# Altium project SecondBoard.PrjPcb
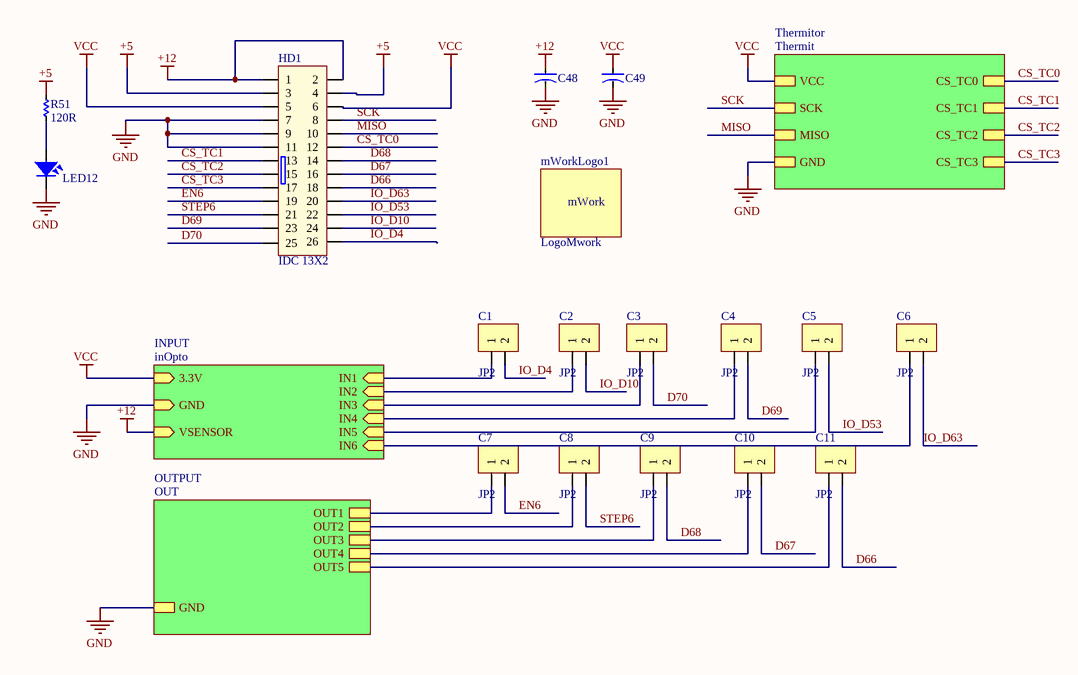
[diagram p0: Main.SchDoc]
4 sheets, 150 parts. Net scope: hierarchical (ports join the sheet entries above them; power ports are global).
Board file: second.PcbDoc
Sheets:
  Main.SchDoc
    Thermitor = Thermit.SchDoc
    INPUT = inOpto.SchDoc
    OUTPUT = OUT.SchDoc

## Sheet Main.SchDoc
size A

### Parts
C1  JP2  [JP2-CLOSED]
C2  JP2  [JP2-CLOSED]
C3  JP2  [JP2-CLOSED]
C4  JP2  [JP2-CLOSED]
C5  JP2  [JP2-CLOSED]
C6  JP2  [JP2-CLOSED]
C7  JP2  [JP2-CLOSED]
C8  JP2  [JP2-CLOSED]
C9  JP2  [JP2-CLOSED]
C10  JP2  [JP2-CLOSED]
C11  JP2  [JP2-CLOSED]
C48  CN-ALU-SMD  [CAP-ALU-SMD-F]  (value not drawn)
C49  CN-ALU-SMD  [CAP-ALU-SMD-F]  (value not drawn)
HD1  IDC 13X2  [IDC26-B]
LED12  LED  [LED-0805-Red]  (value not drawn)
mWorkLogo1  LogoMwork  [LogoMwork30*12]
R51  120R  [RES-SMD-0603_BIG]

### Sub-sheets
INPUT = inOpto: 3.3V (in), VSENSOR (in), GND (in), IN1 (in), IN4 (in), IN3 (in), IN5 (in), IN6 (in), IN2 (in)
OUTPUT = OUT: OUT5, OUT4, OUT1, OUT2, OUT3, GND
Thermitor = Thermit: VCC, SCK, MISO, CS_TC0, CS_TC1, GND, CS_TC2, CS_TC3

### Nets
+5: HD1.3 HD1.4 R51.2
+12: C48.1 HD1.1 HD1.2 ; sheet INPUT/VSENSOR
GND: C48.2 C49.2 HD1.7 HD1.9 HD1.11 LED12.2 ; sheet Thermitor/GND, sheet INPUT/GND, sheet OUTPUT/GND
VCC: C49.1 HD1.5 HD1.6 ; sheet Thermitor/VCC, sheet INPUT/3.3V
CS_TC0: HD1.12 ; sheet Thermitor/CS_TC0
CS_TC1: HD1.13 ; sheet Thermitor/CS_TC1
CS_TC2: HD1.15 ; sheet Thermitor/CS_TC2
CS_TC3: HD1.17 ; sheet Thermitor/CS_TC3
D66: C11.2 HD1.18
D67: C10.2 HD1.16
D68: C9.2 HD1.14
D69: C4.2 HD1.23
D70: C3.2 HD1.25
EN6: C7.2 HD1.19
IO_D4: C1.2 HD1.26
IO_D10: C2.2 HD1.24
IO_D53: C5.2 HD1.22
IO_D63: C6.2 HD1.20
MISO: HD1.10 ; sheet Thermitor/MISO
SCK: HD1.8 ; sheet Thermitor/SCK
STEP6: C8.2 HD1.21
NetC1_1: C1.1 ; sheet INPUT/IN1
NetC2_1: C2.1 ; sheet INPUT/IN2
NetC3_1: C3.1 ; sheet INPUT/IN3
NetC4_1: C4.1 ; sheet INPUT/IN4
NetC5_1: C5.1 ; sheet INPUT/IN5
NetC6_1: C6.1 ; sheet INPUT/IN6
NetC7_1: C7.1 ; sheet OUTPUT/OUT1
NetC8_1: C8.1 ; sheet OUTPUT/OUT2
NetC9_1: C9.1 ; sheet OUTPUT/OUT3
NetC10_1: C10.1 ; sheet OUTPUT/OUT4
NetC11_1: C11.1 ; sheet OUTPUT/OUT5
NetLED12_1: LED12.1 R51.1

### Notes on the sheet
- (in symbol LogoMwork) mWork

### Library data of the parts
C1-C11 = JP2: WR-PHD 2.54 mm Angled Socket Header; Manufacturer: W¨¹rth Elektronik eiSos GmbH; partNo: 613002143121; ComponentLink1 Description: Manufacturer; ComponentLink2 Description: Datasheet; NoPins: 02; Created Date: 29 March 2013; ComponentLink1URL: http://www.we-online.com; ComponentLink2URL: http://katalog.we-online.de/em/datasheet/6130xx143121.pdf; Created by: Karrer Zheng
C48 C49 = CN-ALU-SMD: Polarized Capacitor (Axial); Published: 8-Jun-2000; LatestRevisionDate: 17-Jul-2002; LatestRevisionNote: Re-released for DXP Platform.; PackageReference: POLAR0.8; Publisher: Altium Limited
HD1 = IDC 13X2: Value: Header 5x2
LED12 = LED SMD: Value: LED 3 - 5 ly 2 Colour
R51 = R

## Sheet Thermit.SchDoc
size A
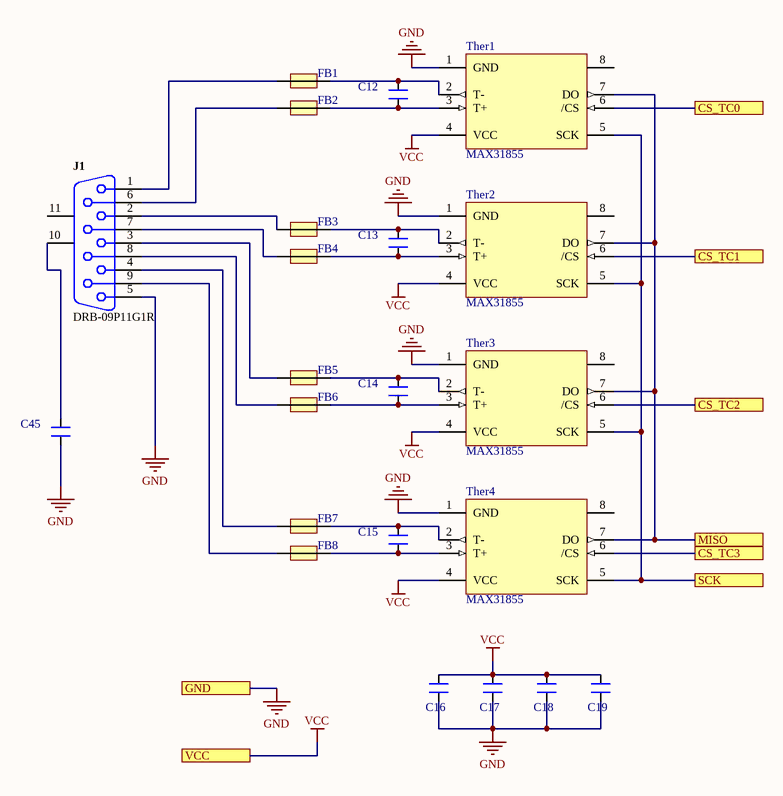
[diagram p1: Thermit.SchDoc]

### Parts
C12  10nF  [CN-SMD-0603_big]  (value not drawn)
C13  10nF  [CN-SMD-0603_big]  (value not drawn)
C14  10nF  [CN-SMD-0603_big]  (value not drawn)
C15  10nF  [CN-SMD-0603_big]  (value not drawn)
C16  100nF  [CN-SMD-0603_big]  (value not drawn)
C17  100nF  [CN-SMD-0603_big]  (value not drawn)
C18  100nF  [CN-SMD-0603_big]  (value not drawn)
C19  100nF  [CN-SMD-0603_big]  (value not drawn)
C45  10nF  [CN-SMD-0603_big]  (value not drawn)
FB1  FB  [Capacitor_805]  (value not drawn)
FB2  FB  [Capacitor_805]  (value not drawn)
FB3  FB  [Capacitor_805]  (value not drawn)
FB4  FB  [Capacitor_805]  (value not drawn)
FB5  FB  [Capacitor_805]  (value not drawn)
FB6  FB  [Capacitor_805]  (value not drawn)
FB7  FB  [Capacitor_805]  (value not drawn)
FB8  FB  [Capacitor_805]  (value not drawn)
J1  DRB-09P11G1R  [DB9_MALE]
Ther1  MAX31855  [SO8]
Ther2  MAX31855  [SO8]
Ther3  MAX31855  [SO8]
Ther4  MAX31855  [SO8]

### Ports
CS_TC0, CS_TC1, CS_TC2, CS_TC3, GND, MISO, SCK, VCC

### Nets
GND: C16.1 C17.1 C18.1 C19.1 C45.1 J1.5 Ther1.1(GND) Ther2.1(GND) Ther3.1(GND) Ther4.1(GND) ; port GND
VCC: C16.2 C17.2 C18.2 C19.2 Ther1.4(VCC) Ther2.4(VCC) Ther3.4(VCC) Ther4.4(VCC) ; port VCC
CS_TC0: Ther1.6(/CS) ; port CS_TC0
CS_TC1: Ther2.6(/CS) ; port CS_TC1
CS_TC2: Ther3.6(/CS) ; port CS_TC2
CS_TC3: Ther4.6(/CS) ; port CS_TC3
MISO: Ther1.7(DO) Ther2.7(DO) Ther3.7(DO) Ther4.7(DO) ; port MISO
SCK: Ther1.5(SCK) Ther2.5(SCK) Ther3.5(SCK) Ther4.5(SCK) ; port SCK
NetC12_1: C12.1 FB2.2 Ther1.3(T+)
NetC12_2: C12.2 FB1.2 Ther1.2(T-)
NetC13_1: C13.1 FB4.2 Ther2.3(T+)
NetC13_2: C13.2 FB3.2 Ther2.2(T-)
NetC14_1: C14.1 FB6.2 Ther3.3(T+)
NetC14_2: C14.2 FB5.2 Ther3.2(T-)
NetC15_1: C15.1 FB8.2 Ther4.3(T+)
NetC15_2: C15.2 FB7.2 Ther4.2(T-)
NetC45_2: C45.2 J1.10(MH1)
NetFB1_1: FB1.1 J1.1
NetFB2_1: FB2.1 J1.6
NetFB3_1: FB3.1 J1.2
NetFB4_1: FB4.1 J1.7
NetFB5_1: FB5.1 J1.3
NetFB6_1: FB6.1 J1.8
NetFB7_1: FB7.1 J1.4
NetFB8_1: FB8.1 J1.9

Not connected (* = marked no-connect by the designer): J1 11(MH2); Ther1 8; Ther2 8; Ther3 8; Ther4 8

### Library data of the parts
C12-C19 C45 = CN: Value: 33pF
J1 = CON 9 Male: Connector, DB9 R/A Through-hole Male; Connector type: Header; Max Current: 3A; Mounting Technology: Through-Hole; Pin Count: 9; Status: Unreleased; Category: Connector
Ther1-Ther4 = MAX31855: ComponentLink1Description: ADUM1201; ComponentLink1URL: https://thegioiic.com/products/adum1201arz

## Sheet inOpto.SchDoc
size A
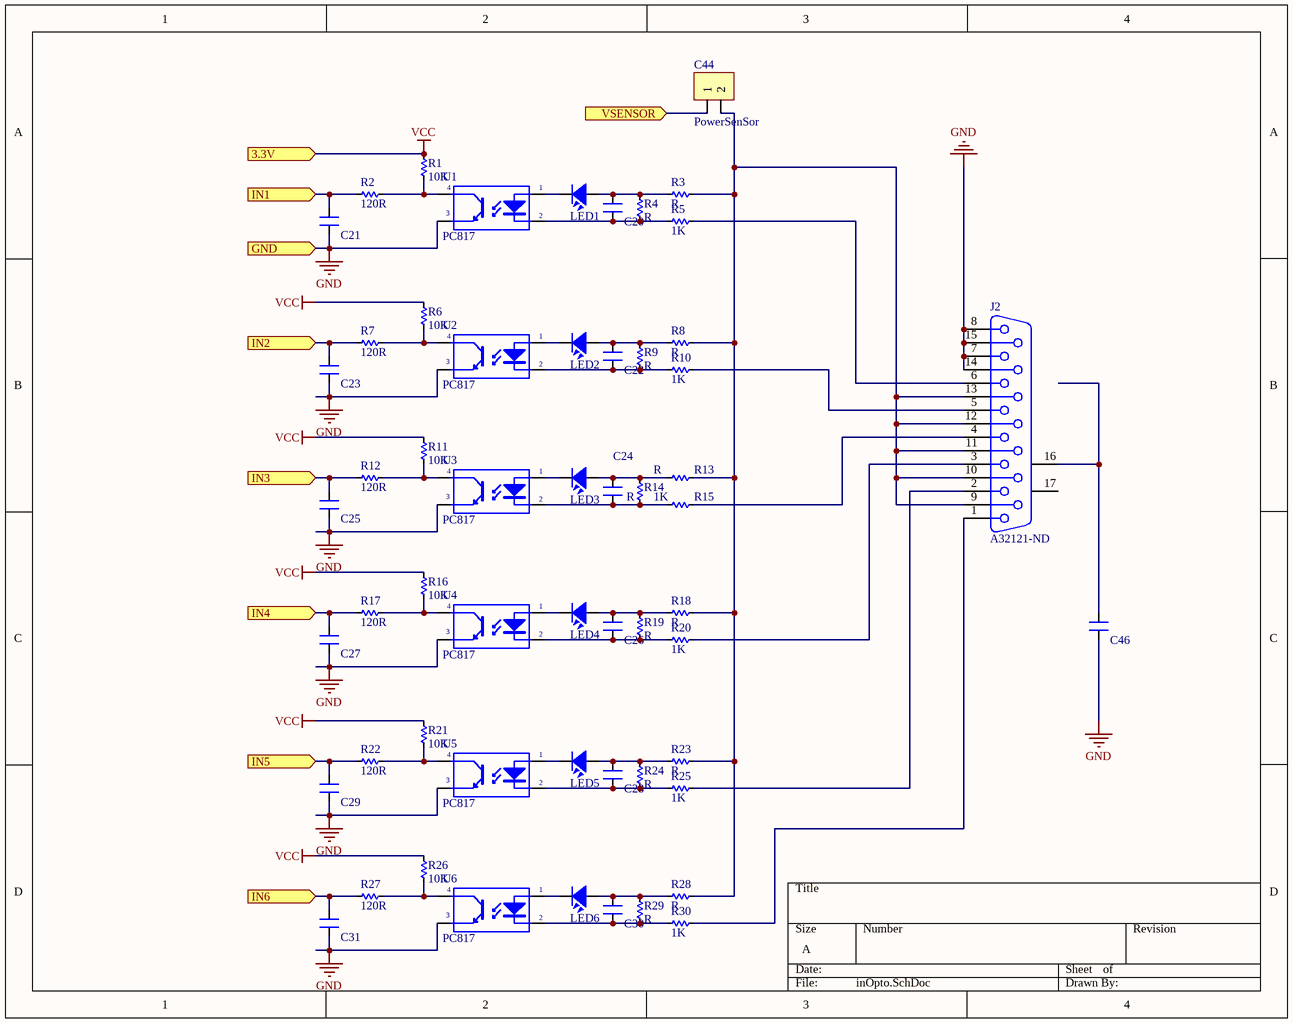
[diagram p2: inOpto.SchDoc]

### Parts
(Parts that share a designator on the sheet are numbered #1, #2 ... from top to bottom, then left to right.)
C20  CN  [CN-SMD-0603_big]  (value not drawn)
C21  CN  [CN-SMD-0603_big]  (value not drawn)
C22  CN  [CN-SMD-0603_big]  (value not drawn)
C23  CN  [CN-SMD-0603_big]  (value not drawn)
C24  CN  [CN-SMD-0603_big]  (value not drawn)
C25  CN  [CN-SMD-0603_big]  (value not drawn)
C26  CN  [CN-SMD-0603_big]  (value not drawn)
C27  CN  [CN-SMD-0603_big]  (value not drawn)
C28  CN  [CN-SMD-0603_big]  (value not drawn)
C29  CN  [CN-SMD-0603_big]  (value not drawn)
C30  CN  [CN-SMD-0603_big]  (value not drawn)
C31  CN  [CN-SMD-0603_big]  (value not drawn)
C44  PowerSenSor  [JP2-CLOSED]
C46  CN  [CN-SMD-0603_big]  (value not drawn)
J2#1  A32121-ND  [DB15]
LED1  MinZ  [LED-0805-Blue]  (value not drawn)
LED2  MinZ  [LED-0805-Blue]  (value not drawn)
LED3  MinZ  [LED-0805-Blue]  (value not drawn)
LED4  MinZ  [LED-0805-Blue]  (value not drawn)
LED5  MinZ  [LED-0805-Blue]  (value not drawn)
LED6  MinZ  [LED-0805-Blue]  (value not drawn)
R1  10K  [RES-SMD-0603_BIG]
R2  120R  [RES-SMD-0603_BIG]
R3  R  [RES-SMD-0603_BIG]
R4  R  [RES-SMD-0603_BIG]
R5  1K  [RES-SMD-0603_BIG]
R6  10K  [RES-SMD-0603_BIG]
R7  120R  [RES-SMD-0603_BIG]
R8  R  [RES-SMD-0603_BIG]
R9  R  [RES-SMD-0603_BIG]
R10  1K  [RES-SMD-0603_BIG]
R11  10K  [RES-SMD-0603_BIG]
R12  120R  [RES-SMD-0603_BIG]
R13  R  [RES-SMD-0603_BIG]
R14  R  [RES-SMD-0603_BIG]
R15  1K  [RES-SMD-0603_BIG]
R16  10K  [RES-SMD-0603_BIG]
R17  120R  [RES-SMD-0603_BIG]
R18  R  [RES-SMD-0603_BIG]
R19  R  [RES-SMD-0603_BIG]
R20  1K  [RES-SMD-0603_BIG]
R21  10K  [RES-SMD-0603_BIG]
R22  120R  [RES-SMD-0603_BIG]
R23  R  [RES-SMD-0603_BIG]
R24  R  [RES-SMD-0603_BIG]
R25  1K  [RES-SMD-0603_BIG]
R26  10K  [RES-SMD-0603_BIG]
R27  120R  [RES-SMD-0603_BIG]
R28  R  [RES-SMD-0603_BIG]
R29  R  [RES-SMD-0603_BIG]
R30  1K  [RES-SMD-0603_BIG]
U1  PC817  [PC817SMT]
U2  PC817  [PC817SMT]
U3  PC817  [PC817SMT]
U4  PC817  [PC817SMT]
U5  PC817  [PC817SMT]
U6  PC817  [PC817SMT]

### Ports
3.3V (in), GND (in), IN1 (in), IN2 (in), IN3 (in), IN4 (in), IN5 (in), IN6 (in), VSENSOR (in)

### Nets
+12: C44.1 ; port VSENSOR
GND: C21.1 C23.1 C25.1 C27.1 C29.1 C31.1 C46.1 J2#1.7 J2#1.8 J2#1.14 J2#1.15 U1.3(E) U2.3(E) U3.3(E) U4.3(E) U5.3(E) U6.3(E) ; port GND
VCC: R1.1 R6.1 R11.1 R16.1 R21.1 R26.1 ; port 3.3V
NetC1_1: C21.2 R2.1 ; port IN1
NetC2_1: C23.2 R7.1 ; port IN2
NetC3_1: C25.2 R12.1 ; port IN3
NetC4_1: C27.2 R17.1 ; port IN4
NetC5_1: C29.2 R22.1 ; port IN5
NetC6_1: C31.2 R27.1 ; port IN6
NetC20_1: C20.1 R4.2 R5.2 U1.2(K)
NetC20_2: C20.2 LED1.1 R3.2 R4.1
NetC22_1: C22.1 R9.2 R10.2 U2.2(K)
NetC22_2: C22.2 LED2.1 R8.2 R9.1
NetC24_1: C24.1 R14.2 R15.2 U3.2(K)
NetC24_2: C24.2 LED3.1 R13.2 R14.1
NetC26_1: C26.1 R19.2 R20.2 U4.2(K)
NetC26_2: C26.2 LED4.1 R18.2 R19.1
NetC28_1: C28.1 R24.2 R25.2 U5.2(K)
NetC28_2: C28.2 LED5.1 R23.2 R24.1
NetC30_1: C30.1 R29.2 R30.2 U6.2(K)
NetC30_2: C30.2 LED6.1 R28.2 R29.1
NetC44_2: C44.2 J2#1.9 J2#1.10 J2#1.11 J2#1.12 J2#1.13 R3.1 R8.1 R13.1 R18.1 R23.1 R28.1
NetC46_2: C46.2 J2#1.16(MH1)
NetJ2#1_1: J2#1.1 R30.1
NetJ2#1_2: J2#1.2 R25.1
NetJ2#1_3: J2#1.3 R20.1
NetJ2#1_4: J2#1.4 R15.1
NetJ2#1_5: J2#1.5 R10.1
NetJ2#1_6: J2#1.6 R5.1
NetLED1_2: LED1.2 U1.1(A)
NetLED2_2: LED2.2 U2.1(A)
NetLED3_2: LED3.2 U3.1(A)
NetLED4_2: LED4.2 U4.1(A)
NetLED5_2: LED5.2 U5.1(A)
NetLED6_2: LED6.2 U6.1(A)
NetR1_2: R1.2 R2.2 U1.4(C)
NetR6_2: R6.2 R7.2 U2.4(C)
NetR11_2: R11.2 R12.2 U3.4(C)
NetR16_2: R16.2 R17.2 U4.4(C)
NetR21_2: R21.2 R22.2 U5.4(C)
NetR26_2: R26.2 R27.2 U6.4(C)

Not connected (* = marked no-connect by the designer): J2#1 17(MH2)

### Library data of the parts
C20-C31 C46 = CN: Value: 33pF
C44 = JP2: as C1 on sheet Main; Created Date: 29 March 2013; ComponentLink1URL: http://www.we-online.com; ComponentLink2URL: http://katalog.we-online.de/em/datasheet/6130xx143121.pdf; Created by: Karrer Zheng
J2#1 = DB15: Receptacle Assembly, 15 Position, Right Angle; PackageDocument: O; Positions: 15; Published: 15-Jun-2001; LatestRevisionDate: 17-Jul-2002; LatestRevisionNote: Re-released for DXP Platform.; DatasheetDocument: 1-Sep-99; PackageReference: 788757; Publisher: Altium Limited; Orientation: Right Angle; Gender: Receptacle
LED1-LED6 = LED SMD: Value: LED 3 - 5 ly 2 Colour
R1 R2 R5-R7 R10-R12 R15-R17 R20-R22 R25-R27 R30 = R
U1-U6 = PC817: Single Opto; Value: PC817

## Sheet OUT.SchDoc
size A
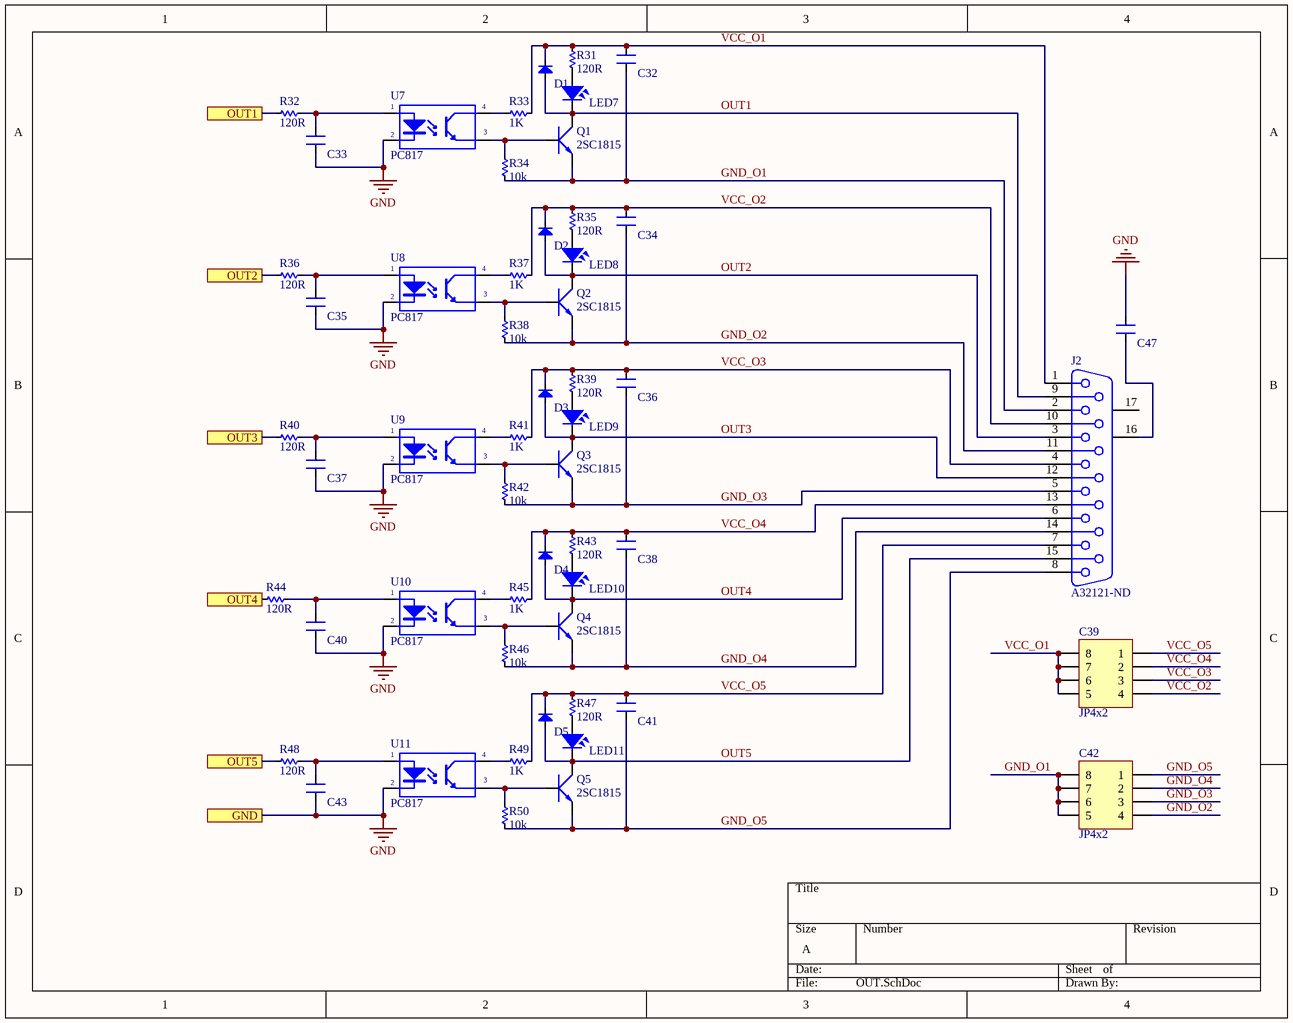
[diagram p3: OUT.SchDoc]

### Parts
(Parts that share a designator on the sheet are numbered #1, #2 ... from top to bottom, then left to right.)
C32  CN  [CN-SMD-0603_big]  (value not drawn)
C33  CN  [CN-SMD-0603_big]  (value not drawn)
C34  CN  [CN-SMD-0603_big]  (value not drawn)
C35  CN  [CN-SMD-0603_big]  (value not drawn)
C36  CN  [CN-SMD-0603_big]  (value not drawn)
C37  CN  [CN-SMD-0603_big]  (value not drawn)
C38  CN  [CN-SMD-0603_big]  (value not drawn)
C39  JP4x2  [JP4-D2T]
C40  CN  [CN-SMD-0603_big]  (value not drawn)
C41  CN  [CN-SMD-0603_big]  (value not drawn)
C42  JP4x2  [JP4-D2T]
C43  CN  [CN-SMD-0603_big]  (value not drawn)
C47  CN  [CN-SMD-0603_big]  (value not drawn)
D1  Diode  [DIO-SMD-106-HayDung]  (value not drawn)
D2  Diode  [DIO-SMD-106-HayDung]  (value not drawn)
D3  Diode  [DIO-SMD-106-HayDung]  (value not drawn)
D4  Diode  [DIO-SMD-106-HayDung]  (value not drawn)
D5  Diode  [DIO-SMD-106-HayDung]  (value not drawn)
J2#2  A32121-ND  [DB15]
LED7  LED  [LED-0805-Red]  (value not drawn)
LED8  LED  [LED-0805-Red]  (value not drawn)
LED9  LED  [LED-0805-Red]  (value not drawn)
LED10  LED  [LED-0805-Red]  (value not drawn)
LED11  LED  [LED-0805-Red]  (value not drawn)
Q1  2SC1815  [TO92-123]
Q2  2SC1815  [TO92-123]
Q3  2SC1815  [TO92-123]
Q4  2SC1815  [TO92-123]
Q5  2SC1815  [TO92-123]
R31  120R  [RES-SMD-0603_BIG]
R32  120R  [RES-SMD-0603_BIG]
R33  1K  [RES-SMD-0603_BIG]
R34  10k  [RES-SMD-0603_BIG]
R35  120R  [RES-SMD-0603_BIG]
R36  120R  [RES-SMD-0603_BIG]
R37  1K  [RES-SMD-0603_BIG]
R38  10k  [RES-SMD-0603_BIG]
R39  120R  [RES-SMD-0603_BIG]
R40  120R  [RES-SMD-0603_BIG]
R41  1K  [RES-SMD-0603_BIG]
R42  10k  [RES-SMD-0603_BIG]
R43  120R  [RES-SMD-0603_BIG]
R44  120R  [RES-SMD-0603_BIG]
R45  1K  [RES-SMD-0603_BIG]
R46  10k  [RES-SMD-0603_BIG]
R47  120R  [RES-SMD-0603_BIG]
R48  120R  [RES-SMD-0603_BIG]
R49  1K  [RES-SMD-0603_BIG]
R50  10k  [RES-SMD-0603_BIG]
U7  PC817  [PC817SMT]
U8  PC817  [PC817SMT]
U9  PC817  [PC817SMT]
U10  PC817  [PC817SMT]
U11  PC817  [PC817SMT]

### Ports
GND, OUT1, OUT2, OUT3, OUT4, OUT5

### Nets
GND: C33.1 C35.1 C37.1 C40.1 C43.1 C47.2 U7.2(K) U8.2(K) U9.2(K) U10.2(K) U11.2(K) ; port GND
GND_O1: C32.1 C42.5 C42.6 C42.7 C42.8 J2#2.2 Q1.1(E) R34.1
GND_O2: C34.1 C42.4 J2#2.11 Q2.1(E) R38.1
GND_O3: C36.1 C42.3 J2#2.5 Q3.1(E) R42.1
GND_O4: C38.1 C42.2 J2#2.14 Q4.1(E) R46.1
GND_O5: C41.1 C42.1 J2#2.8 Q5.1(E) R50.1
OUT1: D1.1(A) J2#2.9 LED7.2 Q1.2(C)
OUT2: D2.1(A) J2#2.3 LED8.2 Q2.2(C)
OUT3: D3.1(A) J2#2.12 LED9.2 Q3.2(C)
OUT4: D4.1(A) J2#2.6 LED10.2 Q4.2(C)
OUT5: D5.1(A) J2#2.15 LED11.2 Q5.2(C)
VCC_O1: C32.2 C39.5 C39.6 C39.7 C39.8 D1.2(K) J2#2.1 R31.2 R33.2
VCC_O2: C34.2 C39.4 D2.2(K) J2#2.10 R35.2 R37.2
VCC_O3: C36.2 C39.3 D3.2(K) J2#2.4 R39.2 R41.2
VCC_O4: C38.2 C39.2 D4.2(K) J2#2.13 R43.2 R45.2
VCC_O5: C39.1 C41.2 D5.2(K) J2#2.7 R47.2 R49.2
NetC7_1: R32.1 ; port OUT1
NetC8_1: R36.1 ; port OUT2
NetC9_1: R40.1 ; port OUT3
NetC10_1: R44.1 ; port OUT4
NetC11_1: R48.1 ; port OUT5
NetC33_2: C33.2 R32.2 U7.1(A)
NetC35_2: C35.2 R36.2 U8.1(A)
NetC37_2: C37.2 R40.2 U9.1(A)
NetC40_2: C40.2 R44.2 U10.1(A)
NetC43_2: C43.2 R48.2 U11.1(A)
NetC47_1: C47.1 J2#2.16(MH1)
NetLED7_1: LED7.1 R31.1
NetLED8_1: LED8.1 R35.1
NetLED9_1: LED9.1 R39.1
NetLED10_1: LED10.1 R43.1
NetLED11_1: LED11.1 R47.1
NetQ1_3: Q1.3(B) R34.2 U7.3(E)
NetQ2_3: Q2.3(B) R38.2 U8.3(E)
NetQ3_3: Q3.3(B) R42.2 U9.3(E)
NetQ4_3: Q4.3(B) R46.2 U10.3(E)
NetQ5_3: Q5.3(B) R50.2 U11.3(E)
NetR33_1: R33.1 U7.4(C)
NetR37_1: R37.1 U8.4(C)
NetR41_1: R41.1 U9.4(C)
NetR45_1: R45.1 U10.4(C)
NetR49_1: R49.1 U11.4(C)

Not connected (* = marked no-connect by the designer): J2#2 17(MH2)

### Library data of the parts
C32-C38 C40 C41 C43 C47 = CN: Value: 33pF
C39 C42 = JP4x2: WR-PHD 2.54 mm Dual Socket Header; Manufacturer: W¨¹rth Elektronik eiSos GmbH; partNo: 61300821821; ComponentLink1 Description: Manufacturer; ComponentLink2 Description: Datasheet; NoPins: 08; Created Date: 29 March 2013; ComponentLink1URL: http://www.we-online.com; ComponentLink2URL: http://katalog.we-online.de/em/datasheet/6130xx21821.pdf; Created by: Karrer Zheng
D1-D5 = Diode: Default Diode; Code - JEDEC: DO-214-AB; Value: 1N5007; Published: 8-Jun-2000; Revision: July-2002: Re-released for DXP Platform.; Publisher: Altium Limited; ComponentLink1Description: ES1J - STMBL; ComponentLink1URL: https://banlinhkien.vn/goods-8089-es1j-do214-diode-1a-600v-sma-es1j-.html
J2#2 = DB15: as J2#1 on sheet inOpto; Published: 15-Jun-2001; LatestRevisionDate: 17-Jul-2002; LatestRevisionNote: Re-released for DXP Platform.; DatasheetDocument: 1-Sep-99; PackageReference: 788757; Publisher: Altium Limited; Orientation: Right Angle; Gender: Receptacle
LED7-LED11 = LED SMD: Value: LED 3 - 5 ly 2 Colour
Q1-Q5 = 2SC1815: NPN 600mW, ECB; Value: C1815
R31-R50 = R
U7-U11 = PC817: Single Opto; Value: PC817

## Nets that join several sheets
+12: Main (C48.1 HD1.1 HD1.2), inOpto (C44.1)
GND: Main (6 pins), Thermit (10 pins), inOpto (17 pins), OUT (11 pins)
VCC: Main (C49.1 HD1.5 HD1.6), Thermit (8 pins), inOpto (6 pins)
CS_TC0: Main (HD1.12), Thermit (Ther1.6)
CS_TC1: Main (HD1.13), Thermit (Ther2.6)
CS_TC2: Main (HD1.15), Thermit (Ther3.6)
CS_TC3: Main (HD1.17), Thermit (Ther4.6)
MISO: Main (HD1.10), Thermit (Ther1.7 Ther2.7 Ther3.7 Ther4.7)
NetC1_1: Main (C1.1), inOpto (C21.2 R2.1)
NetC2_1: Main (C2.1), inOpto (C23.2 R7.1)
NetC3_1: Main (C3.1), inOpto (C25.2 R12.1)
NetC4_1: Main (C4.1), inOpto (C27.2 R17.1)
NetC5_1: Main (C5.1), inOpto (C29.2 R22.1)
NetC6_1: Main (C6.1), inOpto (C31.2 R27.1)
NetC7_1: Main (C7.1), OUT (R32.1)
NetC8_1: Main (C8.1), OUT (R36.1)
NetC9_1: Main (C9.1), OUT (R40.1)
NetC10_1: Main (C10.1), OUT (R44.1)
NetC11_1: Main (C11.1), OUT (R48.1)
SCK: Main (HD1.8), Thermit (Ther1.5 Ther2.5 Ther3.5 Ther4.5)